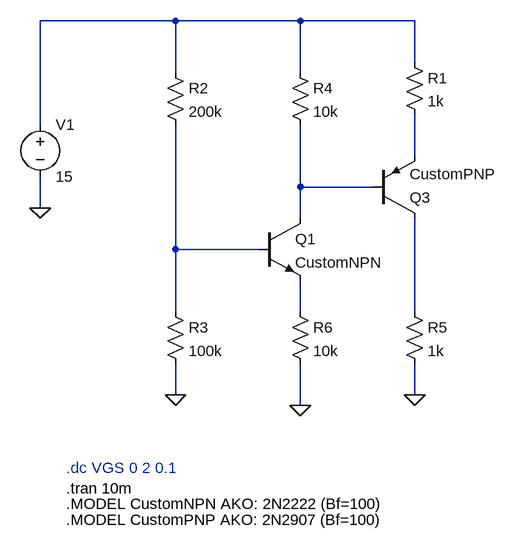
[diagram p0: schematic TotemNPN_PNP.asc]
TotemNPN_PNP.asc, the LTspice schematic file:
Version 4
SHEET 1 888 680
WIRE 224 -160 16 -160
WIRE 416 -160 224 -160
WIRE 592 -160 416 -160
WIRE 592 -96 592 -160
WIRE 224 -80 224 -160
WIRE 416 -80 416 -160
WIRE 16 0 16 -160
WIRE 592 48 592 -16
WIRE 416 96 416 0
WIRE 528 96 416 96
WIRE 16 128 16 80
WIRE 416 144 416 96
WIRE 224 192 224 0
WIRE 352 192 224 192
WIRE 224 288 224 192
WIRE 416 288 416 240
WIRE 592 288 592 144
WIRE 224 416 224 368
WIRE 592 416 592 368
WIRE 416 432 416 368
FLAG 16 128 0
FLAG 224 416 0
FLAG 592 416 0
FLAG 416 432 0
SYMBOL npn 352 144 R0
SYMATTR InstName Q1
SYMATTR Value CustomNPN
SYMBOL voltage 16 -16 R0
WINDOW 123 0 0 Left 0
WINDOW 39 0 0 Left 0
SYMATTR InstName V1
SYMATTR Value 15
SYMBOL res 576 -112 R0
SYMATTR InstName R1
SYMATTR Value 1k
SYMBOL res 208 -96 R0
SYMATTR InstName R2
SYMATTR Value 200k
SYMBOL pnp 528 144 M180
SYMATTR InstName Q3
SYMATTR Value CustomPNP
SYMBOL res 208 272 R0
SYMATTR InstName R3
SYMATTR Value 100k
SYMBOL res 400 -96 R0
SYMATTR InstName R4
SYMATTR Value 10k
SYMBOL res 576 272 R0
SYMATTR InstName R5
SYMATTR Value 1k
SYMBOL res 400 272 R0
SYMATTR InstName R6
SYMATTR Value 10k
TEXT 56 528 Left 2 ;.dc VGS 0 2 0.1
TEXT 56 560 Left 2 !.tran 10m
TEXT 56 584 Left 2 !.MODEL CustomNPN AKO: 2N2222 (Bf=100)
TEXT 56 608 Left 2 !.MODEL CustomPNP AKO: 2N2907 (Bf=100)

The netlist it stands for:
* TotemNPN_PNP.asc
Q1 N003 N004 N005 0 CustomNPN
V1 N001 0 15
R1 N001 N002 1k
R2 N001 N004 200k
Q3 N006 N003 N002 0 CustomPNP
R3 N004 0 100k
R4 N001 N003 10k
R5 N006 0 1k
R6 N005 0 10k
.model NPN NPN
.model PNP PNP
.lib standard.bjt
* .dc VGS 0 2 0.1
.tran 10m
.MODEL CustomNPN AKO: 2N2222 (Bf=100)
.MODEL CustomPNP AKO: 2N2907 (Bf=100)
.backanno
.end